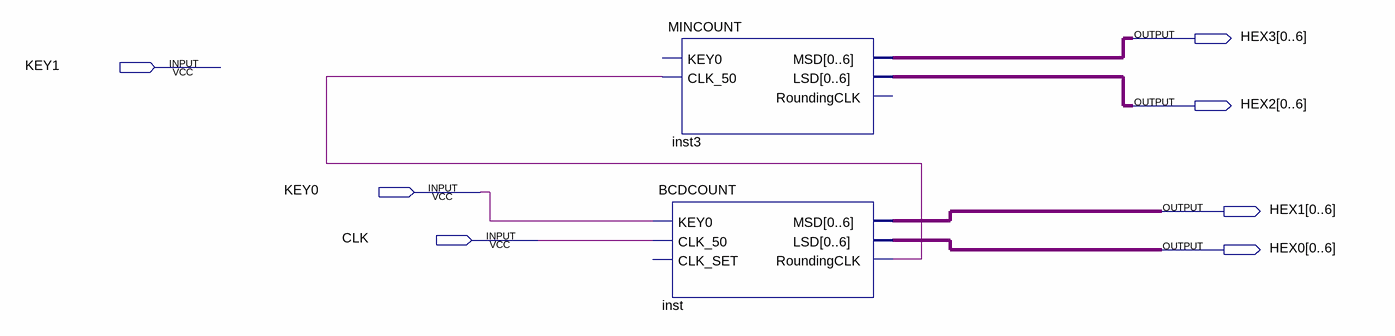
[diagram p0: schematic sheet]
// Quartus schematic Lab3_Part2.bdf as structural Verilog: 2 symbols, 7 pins
module Lab3_Part2 (
  input  KEY1,
  input  KEY0,
  input  CLK,
  output [0:6] HEX3,
  output [0:6] HEX2,
  output [0:6] HEX1,
  output [0:6] HEX0
);

  wire inst_roundingclk;

  MINCOUNT inst3 (.CLK_50(inst_roundingclk), .MSD(HEX3), .LSD(HEX2));  // open: KEY0, RoundingCLK
  BCDCOUNT inst (.KEY0(KEY0), .CLK_50(CLK), .MSD(HEX1), .LSD(HEX0), .RoundingCLK(inst_roundingclk));  // open: CLK_SET
endmodule
